# Altium schematic sheet pic_blk.SchDoc
size A4; Engineer: JBayalas; DocumentNumber: 11; Revision: V1.1; SheetNumber: 11; SheetTotal: 13
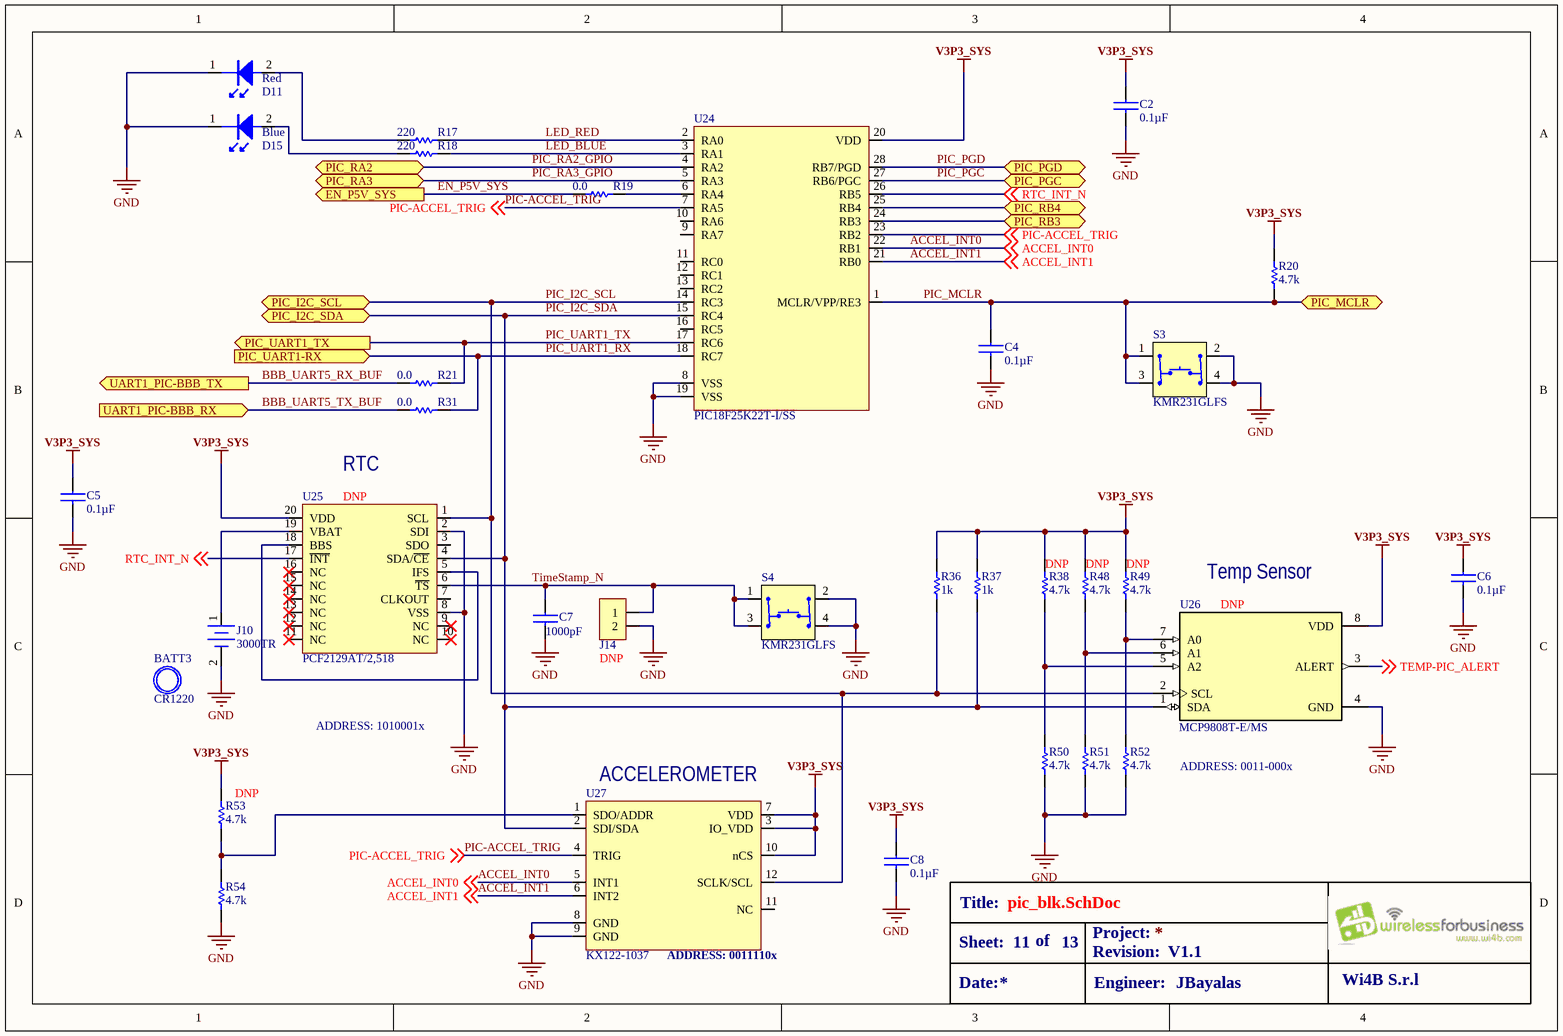
[diagram p0: pic_blk.SchDoc]

## Parts
BATT3  CR1220
C2  value 0.1µF  [C0402]  (hidden comment: *)
C4  value 0.1µF  [C0402]  (hidden comment: *)
C5  value 0.1µF  [C0402]  (hidden comment: *)
C6  value 0.1µF  [C0402]  (hidden comment: *)
C7  value 1000pF  [C0402]  (hidden comment: *)
C8  value 0.1µF  [C0402]  (hidden comment: *)
D11  value Red  [LED0402(RED)]  (hidden comment: *)
D15  value Blue  [LED0402(BLUE)]  (hidden comment: *)
J10  3000TR  [3000TR]
J14  LOAD: DNP  [2pin 5mm Pitch]  (hidden comment: *)
R17  value 220  [R0402]  (hidden comment: *)
R18  value 220  [R0402]  (hidden comment: *)
R19  value 0.0  [R0402]  (hidden comment: *)
R20  value 4.7k  [R0603]  (hidden comment: *)
R21  value 0.0  [R0402]  (hidden comment: *)
R31  value 0.0  [R0402]  (hidden comment: *)
R36  value 1k  [R0402]  (hidden comment: *)
R37  value 1k  [R0402]  (hidden comment: *)
R38  value 4.7k  LOAD: DNP  [R0402]  (hidden comment: *)
R48  value 4.7k  LOAD: DNP  [R0402]  (hidden comment: *)
R49  value 4.7k  LOAD: DNP  [R0402]  (hidden comment: *)
R50  value 4.7k  [R0402]  (hidden comment: *)
R51  value 4.7k  [R0402]  (hidden comment: *)
R52  value 4.7k  [R0402]  (hidden comment: *)
R53  value 4.7k  LOAD: DNP  [R0402]  (hidden comment: *)
R54  value 4.7k  [R0402]  (hidden comment: *)
S3  *  [KMR231G ULC LFS]  (value not drawn)
S4  *  [KMR231G ULC LFS]  (value not drawn)
U24  value PIC18F25K22T-I/SS  [SSOP-28 (PIC)]  (hidden comment: *)
U25  value PCF2129AT/2,518  LOAD: DNP  [SOIC-20]  (hidden comment: *)
U26  LOAD: DNP  [SOP65P490X110-8N]  (hidden comment: MCP9808T-E/MS)
U27  *  [KX122-1037]  (value not drawn)

## Ports
EN_P5V_SYS (out), PIC_I2C_SCL (bidir), PIC_I2C_SDA (bidir), PIC_MCLR (bidir), PIC_PGC (bidir), PIC_PGD (bidir), PIC_RA2 (bidir), PIC_RA3 (bidir), PIC_RB3 (bidir), PIC_RB4 (bidir), PIC_UART1-RX (in), PIC_UART1_TX (out), UART1_PIC-BBB_RX (in), UART1_PIC-BBB_TX (out)

## Nets
GND: C2.2 C4.2 C5.2 C6.2 C7.2 C8.2 D11.1 D15.1 J10.2(-) J14.2 R50.1 R51.1 R52.1 R54.1 S3.2 S3.4 S4.2 S4.4 U24.8(VSS) U24.19(VSS) U25.2(SDI) U25.8(VSS) U26.4(GND) U27.8(GND) U27.9(GND)
V3P3_SYS: C2.1 C5.1 C6.1 C8.1 R20.2 R36.2 R37.2 R38.2 R48.2 R49.2 R53.2 U24.20(VDD) U25.20(VDD) U26.8(VDD) U27.3(IO_VDD) U27.7(VDD) U27.10(nCS)
ACCEL_INT0: U24.22(RB1) U27.5(INT1) ; off-sheet ACCEL_INT0
ACCEL_INT1: U24.21(RB0) U27.6(INT2) ; off-sheet ACCEL_INT1
BBB_UART5_RX_BUF: R21.2 ; port UART1_PIC-BBB_TX
BBB_UART5_TX_BUF: R31.2 ; port UART1_PIC-BBB_RX
EN_P5V_SYS: R19.2 ; port EN_P5V_SYS
LED_BLUE: R18.2 U24.3(RA1)
LED_RED: R17.2 U24.2(RA0)
PIC-ACCEL_TRIG: U24.7(RA5) U24.23(RB2) U27.4(TRIG) ; off-sheet PIC-ACCEL_TRIG
PIC_I2C_SCL: R36.1 U24.14(RC3) U25.1(SCL) U26.2(SCL) U27.12(SCLK/SCL) ; port PIC_I2C_SCL
PIC_I2C_SDA: R37.1 U24.15(RC4) U25.4(SDA/~{CE}) U26.1(SDA) U27.2(SDI/SDA) ; port PIC_I2C_SDA
PIC_MCLR: C4.1 R20.1 S3.1 S3.3 U24.1(MCLR/VPP/RE3) ; port PIC_MCLR
PIC_PGC: U24.27(RB6/PGC) ; port PIC_PGC
PIC_PGD: U24.28(RB7/PGD) ; port PIC_PGD
PIC_RA2_GPIO: U24.4(RA2) ; port PIC_RA2
PIC_RA3_GPIO: U24.5(RA3) ; port PIC_RA3
PIC_RB3: U24.24(RB3) ; port PIC_RB3
PIC_RB4: U24.25(RB4) ; port PIC_RB4
PIC_UART1_RX: R31.1 U24.18(RC7) ; port PIC_UART1-RX
PIC_UART1_TX: R21.1 U24.17(RC6) ; port PIC_UART1_TX
RTC_INT_N: U24.26(RB5) U25.17(~{INT}) ; off-sheet RTC_INT_N
TEMP-PIC_ALERT: U26.3(ALERT) ; off-sheet TEMP-PIC_ALERT
TimeStamp_N: C7.1 J14.1 S4.1 S4.3 U25.6(~{TS})
NetD11_2: D11.2 R17.1
NetD15_2: D15.2 R18.1
NetJ10_1: J10.1(+) U25.19(VBAT)
NetR19_1: R19.1 U24.6(RA4)
NetR38_1: R38.1 R50.2 U26.5(A2)
NetR48_1: R48.1 R51.2 U26.6(A1)
NetR49_1: R49.1 R52.2 U26.7(A0)
NetR53_1: R53.1 R54.2 U27.1(SDO/ADDR)
NetU25_5: U25.5(IFS) U25.18(BBS)

Not connected (* = marked no-connect by the designer): U24 9(RA7) 10(RA6) 11(RC0) 12(RC1) 13(RC2) 16(RC5); U25 3(SDO) 7(CLKOUT) 9(NC)* 10(NC)* 11(NC)* 12(NC)* 13(NC)* 14(NC)* 15(NC)* 16(NC)*; U27 11(NC)

## Notes on the sheet
- RTC
- (near U26) Temp Sensor
- ADDRESS: 1010001x
- (near U27) ACCELEROMETER
- ADDRESS: 0011-000x
- (near U27) ADDRESS: 0011110x
- Title:
- Sheet:
- Date:
- of
- Project:
- Revision:
- Engineer:
- Wi4B S.r.l

## Library data of the parts
BATT3 = CR1220: Coin Cell Battery 35mAh 12.5mm; MFT: FDK; RATING: 3V, 35mAh; FUNCTION: PIC; TYPE: SMD; LOAD: *; VALUE: CR1220; MPN: CR1220
C2 C4-C6 C8 = CL05B104KO3LNNC: CAP CER 0.1UF 16V X7R 0402; MFT: Samsung Electro-Mechanics America, Inc.; RATING: ±10%, 16V; TYPE: Surface Mount, MLCC; FUNCTION: PIC; MPN: CL05B104KO3LNNC
C7 = GRM155R71H102KA01D: CAP CER 1000PF 50V X7R 0402; MFT: Murata Electronics North America; TYPE: SMD; FUNCTION: PIC; MPN: GRM155R71H102KA01D; LOAD: *; RATING: 50V
D11 = LNJ247W82RA: LED RED 0402 SMD; MFT: Panasonic Electronic Components; TYPE: Surface Mount; FUNCTION: PIC; MPN: LNJ247W82RA
D15 = VLMB1500-GS08: LED BLUE 0402 SMD; MFT: Vishay Semiconductor Opto Division; FUNCTION: PIC; MPN: VLMB1500-GS08; TYPE: SMD; RATING: *; LOAD: *
J10 = 3000TR: Coin Cell Battery Holders SM COIN CELL B/H; MFT: Keystone Electronics; FUNCTION: PIC; MPN: 3000TR; TYPE: SMD; RATING: *; LOAD: *; VALUE: 3000TR
J14 = 2PIN Signal 5mm Pitch: FUNCTION: PIC
R17 R18 = RC0402JR-07220RL: RES SMD 220 OHM 5% 1/16W 0402; MFT: Yageo; FUNCTION: PIC; MPN: RC0402JR-07220RL; RATING: *; TYPE: SMD; LOAD: *
R19 R21 R31 = CRCW04020000Z0ED: RES SMD 0.0OHM JUMPER 1/16W 0402; MFT: Vishay Dale; RATING: 63mW; FUNCTION: PIC; MPN: CRCW04020000Z0ED; TYPE: Surface Mount
R20 = ERA-3AEB472V: RES SMD 4.7K OHM 0.1% 1/10W 0603; MFT: Panasonic; FUNCTION: PIC; MPN: ERA-3AEB472V; LOAD: *; RATING: 1/10W; TYPE: SMD
R36 R37 = MCS04020C1001FE000: RES SMD 1K OHM 1% 1/10W 0402; MFT: Vishay Beyschlag; FUNCTION: PIC; MPN: MCS04020C1001FE000; TYPE: SMD; RATING: 1/10W; LOAD: *
R38 R48-R54 = RC0402JR-074K7L: RES SMD 4.7K OHM 5% 1/16W 0402; MFT: Yageo; FUNCTION: PIC; MPN: RC0402JR-074K7L; RATING: ±5%; TYPE: Surface Mount
S3 S4 = KMR231GLFS: SWITCH TACTILE SPST-NO 0.05A 32V; MFT: C&K Components; FUNCTION: PIC; VALUE: KMR231GLFS; TYPE: SMD; MPN: KMR231GLFS
U24 = PIC18F25K22T-I/SS: MCU 8BIT 32KB FLASH 28SSOP; MFT: Microchip; FUNCTION: PIC; MPN: PIC18F25K22T-I/SS; TYPE: SMD; RATING: *; LOAD: *
U25 = PCF2129AT/2,518: IC RTC /CALENDAR TCXO QTZ 20SOIC; MFT: NXP Semiconductors; FUNCTION: PIC; MPN: PCF2129AT/2,518; TYPE: SMD; RATING: *
U26 = MCP9808T-E/MS: MCP9808 Series 3.6 V Memory Module Digital Temperature Sensor SMT - MSOP-8; MFT: Microchip; FUNCTION: PIC; MPN: MCP9808T-E/MS; TYPE: SMD; RATING: *; VALUE: MCP9808T-E/MS
U27 = KX122-1037: ACCELEROMETER 2-8G I2C/SPI 12LGA; MFT: Kionix Inc.; FUNCTION: PIC; LOAD: *; RATING: *; TYPE: SMD; VALUE: KX122-1037; MPN: KX122-1037